# EAGLE design double_coil_driver (EAGLE 7.0.0)
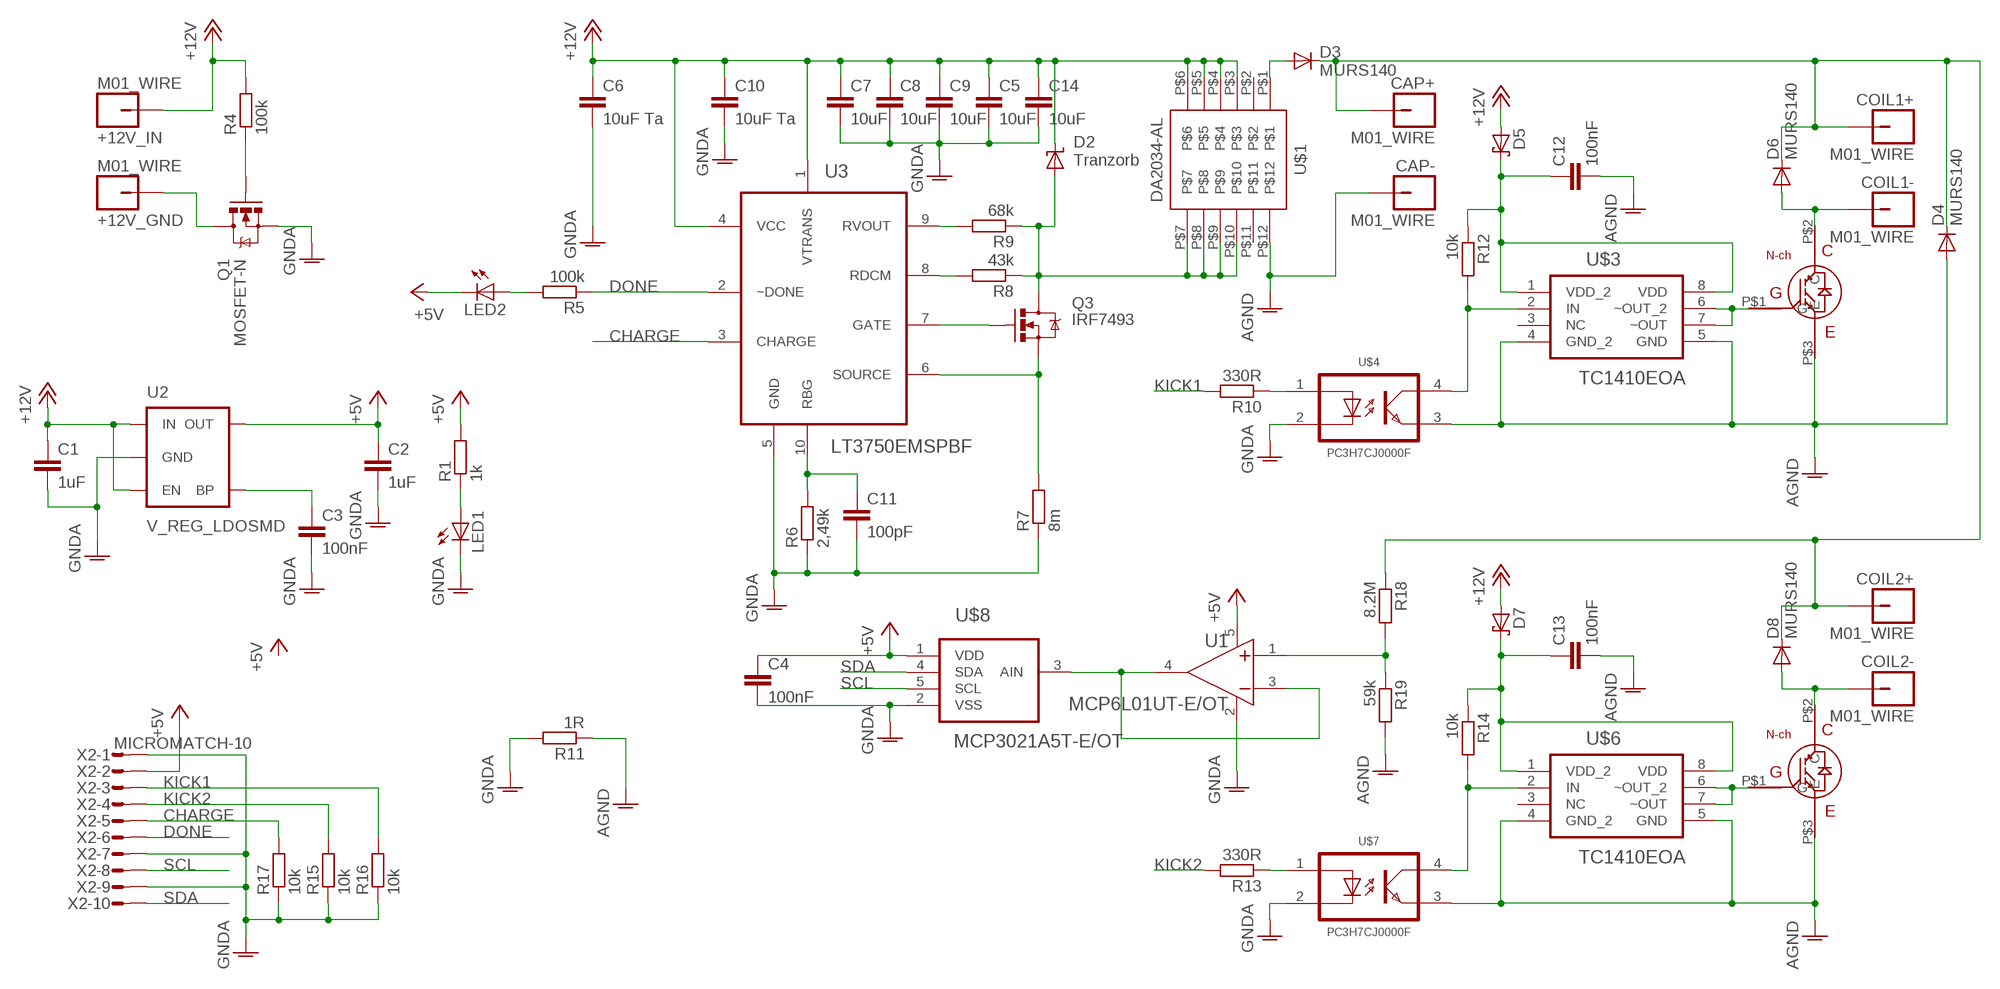
[diagram p0: schematic, sheet 1]

## Parts
+12V_GND  M01_WIRE  [WIRE_HOLE]
+12V_IN  M01_WIRE  [WIRE_HOLE]
C1  1uF  C-EUC1206K  [C1206K]
C2  1uF  C-EUC1206K  [C1206K]
C3  100nF  C-EUC0603K  [C0603K]
C4  100nF  C-EUC0603K  [C0603K]
C5  10uF  C-EUC1210K  [C1210K]
C6  10uF Ta  C-EUC1210K  [C1210K]
C7  10uF  C-EUC1210K  [C1210K]
C8  10uF  C-EUC1210K  [C1210K]
C9  10uF  C-EUC1210K  [C1210K]
C10  10uF Ta  C-EUC1210K  [C1210K]
C11  100pF  C-EUC0603  [C0603]
C12  100nF  C-EUC0603K  [C0603K]
C13  100nF  C-EUC0603K  [C0603K]
C14  10uF  C-EUC1210K  [C1210K]
CAP+  M01_WIRE  [WIRE_HOLE]
CAP-  M01_WIRE  [WIRE_HOLE]
COIL1+  M01_WIRE  [WIRE_HOLE]
COIL1-  M01_WIRE  [WIRE_HOLE]
COIL2+  M01_WIRE  [WIRE_HOLE]
COIL2-  M01_WIRE  [WIRE_HOLE]
D2  Tranzorb  SUPPRESSOR-SMC  [SMC]
D3  MURS140  DIODE-DO214AA  [DO214AA]
D4  MURS140  DIODE-DO214AA  [DO214AA]
D5  SCHOTTKY-DIODE  [SOD123]
D6  MURS140  DIODE-DO214AA  [DO214AA]
D7  SCHOTTKY-DIODE  [SOD123]
D8  MURS140  DIODE-DO214AA  [DO214AA]
LED1  LEDCHIP-LED0603  [CHIP-LED0603]
LED2  LEDCHIP-LED0603  [CHIP-LED0603]
Q1  MOSFET-N  MOSFET-NCHANNELFDS6630A  [SO08]
Q3  IRF7493  MOSFET-NCHANNELFDS6630A  [SO08]
R1  1k  R-EU_R0603  [R0603]
R4  100k  R-EU_R0603  [R0603]
R5  100k  R-EU_R0603  [R0603]
R6  2,49k  R-EU_R0603  [R0603]
R7  8m  R-EU_R2010  [R2010]
R8  43k  R-EU_R0603  [R0603]
R9  68k  R-EU_R0603  [R0603]
R10  330R  R-EU_R0603  [R0603]
R11  1R  R-EU_R0603  [R0603]
R12  10k  R-EU_R0603  [R0603]
R13  330R  R-EU_R0603  [R0603]
R14  10k  R-EU_R0603  [R0603]
R15  10k  R-EU_R0603  [R0603]
R16  10k  R-EU_R0603  [R0603]
R17  10k  R-EU_R0603  [R0603]
R18  8.2M  R-EU_R0603  [R0603]
R19  59k  R-EU_R0603  [R0603]
U1  MCP6L01UT-E/OT  [SOT95P270X145-5N]
U2  V_REG_LDOSMD  [SOT23-5]
U3  LT3750EMSPBF  [SOP50P490X110-10N]
U$1  DA2034-AL  DA2034-AL-SQUARE  [DA2034-AL]
U$2  TO-247A  [TO-247]
U$3  TC1410EOA  [SOIC127P600X175-8N]
U$4  PC3H7CJ0000F  [MINI-FLAT-HALF-PITCH-4]
U$5  TO-247A  [TO-247]
U$6  TC1410EOA  [SOIC127P600X175-8N]
U$7  PC3H7CJ0000F  [MINI-FLAT-HALF-PITCH-4]
U$8  MCP3021A5T-E/OT  [SOT95P270X145-5N]
X2  MICROMATCH-10  [MICROMATCH-10]

## Nets
+5V: C2.1 C4.1 LED2.C R1.2 U1.5(VDD) U2.5(OUT) U$8.1(VDD) X2.2
+12V: +12V_IN.P$1 C1.1 C5.1 C6.1 C7.1 C8.1 C9.1 C10.1 C14.1 D2.C D5.A D7.A R4.2 U2.1(IN) U2.3(EN) U3.1(VTRANS) U3.4(VCC) U$1.P$3 U$1.P$4 U$1.P$5 U$1.P$6
AGND: C12.2 C13.2 CAP-.P$1 D4.A R11.1 R19.2 U$1.P$12 U$2.P$3(E) U$3.4(GND_2) U$3.5(GND) U$4.3 U$5.P$3(E) U$6.4(GND_2) U$6.5(GND) U$7.3
CHARGE: R17.2 U3.3(CHARGE) X2.5
DONE: R5.1 U3.2(~DONE) X2.6
GNDA: C1.2 C2.2 C3.2 C4.2 C5.2 C6.2 C7.2 C8.2 C9.2 C10.2 C11.2 C14.2 LED1.C Q1.1(S) Q1.2(S) Q1.3(S) R6.1 R7.1 R11.2 R15.1 R16.1 R17.1 U1.2(VSS) U2.2(GND) U3.5(GND) U$4.2 U$7.2 U$8.2(VSS) X2.1 X2.7 X2.9
KICK1: R10.2 R16.2 X2.3
KICK2: R13.2 R15.2 X2.4
N$1: +12V_GND.P$1 Q1.5(D) Q1.6(D) Q1.7(D) Q1.8(D)
N$2: C3.1 U2.4(BP)
N$3: R18.2 R19.1 U1.1(VIN+)
N$4: LED1.A R1.1
N$5: U1.3(VIN-) U1.4(VOUT) U$8.3(AIN)
N$6: Q3.4(G) U3.7(GATE)
N$7: Q1.4(G) R4.1
N$8: LED2.A R5.2
N$9: C11.1 R6.2 U3.10(RBG)
N$10: Q3.1(S) Q3.2(S) Q3.3(S) R7.2 U3.6(SOURCE)
N$11: R8.2 U3.8(RDCM)
N$12: R9.2 U3.9(RVOUT)
N$13: D2.A Q3.5(D) Q3.6(D) Q3.7(D) Q3.8(D) R8.1 R9.1 U$1.P$7 U$1.P$8 U$1.P$9 U$1.P$10
N$14: D3.A U$1.P$1
N$15: CAP+.P$1 COIL1+.P$1 COIL2+.P$1 D3.C D4.C D6.C D8.C R18.1
N$16: COIL1-.P$1 D6.A U$2.P$2(C)
N$17: U$2.P$1(G) U$3.6(~OUT_2) U$3.7(~OUT)
N$18: R12.2 U$3.2(IN) U$4.4
N$19: R10.1 U$4.1
N$21: C12.1 D5.C R12.1 U$3.1(VDD_2) U$3.8(VDD)
N$23: COIL2-.P$1 D8.A U$5.P$2(C)
N$24: U$5.P$1(G) U$6.6(~OUT_2) U$6.7(~OUT)
N$25: R14.2 U$6.2(IN) U$7.4
N$26: R13.1 U$7.1
N$27: C13.1 D7.C R14.1 U$6.1(VDD_2) U$6.8(VDD)
SCL: U$8.5(SCL) X2.8
SDA: U$8.4(SDA) X2.10
Unconnected: U$1.P$2 U$1.P$11 U$3.3(NC) U$6.3(NC)

## Library data of the parts
+12V_GND +12V_IN CAP+ CAP- COIL1+ COIL1- COIL2+ COIL2- = tellis2:M01_WIRE
C1-C14 = rcl:C-EU: CAPACITOR, European symbol
D2 = diode:SUPPRESSOR-: Suppressor diode
D3 D4 D6 D8 = diode:DIODE-: DIODE
D5 D7 = diode:SCHOTTKY-DIODE: Schottky Diode
LED1 LED2 = led:LED: LED OSRAM: - CHIPLED LG R971, LG N971, LY N971, LG Q971, LY Q971, LO R971, LY R971 LH N974, LH R974 LS Q976, LO Q976, LY Q976 LO Q996 - Hyper CHIPLED LW Q18S LB Q993, LB Q99A, LB R99A - SideLED LS A670, LO A670, LY A670, LG A670, LP A670 LB A673, LV A673, LT A673, LW A673 LH A674 LY A675 LS A676, LA A676, LO A676, LY A676, LW A676 LS A679, LY A679, LG A679 - Hyper Micro SIDELED® LS Y876, LA Y876, LO Y876, LY Y876 LT Y87S - SmartLED LW L88C, LW L88S LB L89C, LB L89S, LG L890 LS L89K, LO L89K, LY L89K LS L896, LA L896, LO L896, LY L896 - TOPLED LS T670, LO T670, LY T670, LG T670, LP T670 LSG T670, LSP T670, LSY T670, LOP T670, LYG T670 LG T671, LOG T671, LSG T671 LB T673, LV T673, LT T673, LW T673 LH T674 LS T676, LA T676, LO T676, LY T676, LB T676, LH T676, LSB T676, LW T676 LB T67C, LV T67C, LT T67C, LS T67K, LO T67K, LY T67K, LW E67C LS E67B, LA E67B, LO E67B, LY E67B, LB E67C, LV E67C, LT E67C LW T67C LS T679, LY T679, LG T679 LS T770, LO T770, LY T770, LG T770, LP T770 LB T773, LV T773, LT T773, LW T773 LH T774 LS E675, LA E675, LY E675, LS T675 LS T776, LA T776, LO T776, LY T776, LB T776 LHGB T686 LT T68C, LB T68C - Hyper Mini TOPLED® LB M676 - Mini TOPLED Santana® LG M470 LS M47K, LO M47K, LY M47K Source: http://www.osram.convergy.de LUXEON: - LUMILED® LXK2-PW12-R00, LXK2-PW12-S00, LXK2-PW14-U00, LXK2-PW14-V00 LXK2-PM12-R00, LXK2-PM12-S00, LXK2-PM14-U00 LXK2-PE12-Q00, LXK2-PE12-R00, LXK2-PE12-S00, LXK2-PE14-T00, LXK2-PE14-U00 LXK2-PB12-K00, LXK2-PB12-L00, LXK2-PB12-M00, LXK2-PB14-N00, LXK2-PB14-P00, LXK2-PB14-Q00 LXK2-PR12-L00, LXK2-PR12-M00, LXK2-PR14-Q00, LXK2-PR14-R00 LXK2-PD12-Q00, LXK2-PD12-R00, LXK2-PD12-S00 LXK2-PH12-R00, LXK2-PH12-S00 LXK2-PL12-P00, LXK2-PL12-Q00, LXK2-PL12-R00 Source: www.luxeon.com KINGBRIGHT: KA-3528ASYC Source: www.kingbright.com
Q1 Q3 = SparkFun-DiscreteSemi:MOSFET-NCHANNEL: Common NMOSFET Parts MFG P/N Store ID Prod ID FDD8780 TRANS-09984 SI7820DN TRANS-11055 FDS6630A IC-08089 2N7002PW TRANS-11151 FQP30N06L COM-10213 TRANS-10060 BSS123LT1G TRANS-08345 BSS138 TRANS-00830 BS170 2N7000; PROD_ID: IC-08089
R1 R4-R19 = rcl:R-EU_: RESISTOR, European symbol
U1 = opamp-MCP6L01U:MCP6L01UT-E/OT: IC, 1 MHz, 85 uA Single Op Amps, 1.8V, SOT23-5; MPN: MCP6L01UT-E/OT; OC_FARNELL: 1852141; OC_NEWARK: 08R1813; PACKAGE: SOT23-5; SUPPLIER: Microchip
U2 = SparkFun-PowerIC:V_REG_LDO: Voltage Regulator LDO Standard 150mA LDO voltage regulator in SOT-23 layout. Micrel part MIC5205. BP (by-pass) pin is used to lower output noise with 470pF cap.
U3 = LT3750:LT3750EMSPBF: Capacitor Charger Controller; MPN: LT3750EMS#PBF; OC_FARNELL: 1273500; OC_NEWARK: 57M8591; PACKAGE: MSOP-10; SUPPLIER: Linear Technology
U$1 = inductor-coilcraft-2:DA2034-AL-SQUARE
U$2 U$5 = to-247_n-channel_igbt-modified-pads:TO-247
U$3 U$6 = TC1410:TC1410EOA: 0.5A High-Speed MOSFET Drivers; MPN: TC1410EOA; OC_FARNELL: 1834893; OC_NEWARK: 92C5892; PACKAGE: SOIC-8; SUPPLIER: Microchip
U$4 U$7 = optocoupler-PC3H7CJ0000F:PC3H7CJ0000F
U$8 = ADC-I2C-MCP3021:MCP3021A5T-E/OT: A/D Converter; MPN: MCP3021A5T-E/OT; OC_FARNELL: 1332097; OC_NEWARK: 34M7445; PACKAGE: SOT-5; SUPPLIER: Microchip
X2 = con-amp-micromatch:MICROMATCH-10: MicroMaTch 10 8-215464-0 / 1-215464-0 Drawing Number C-215464 DDEController.pdf; MF: FARNELL; MPN: 8-215464-0; OC_FARNELL: 3784654; OC_NEWARK: 19J6430

## Board
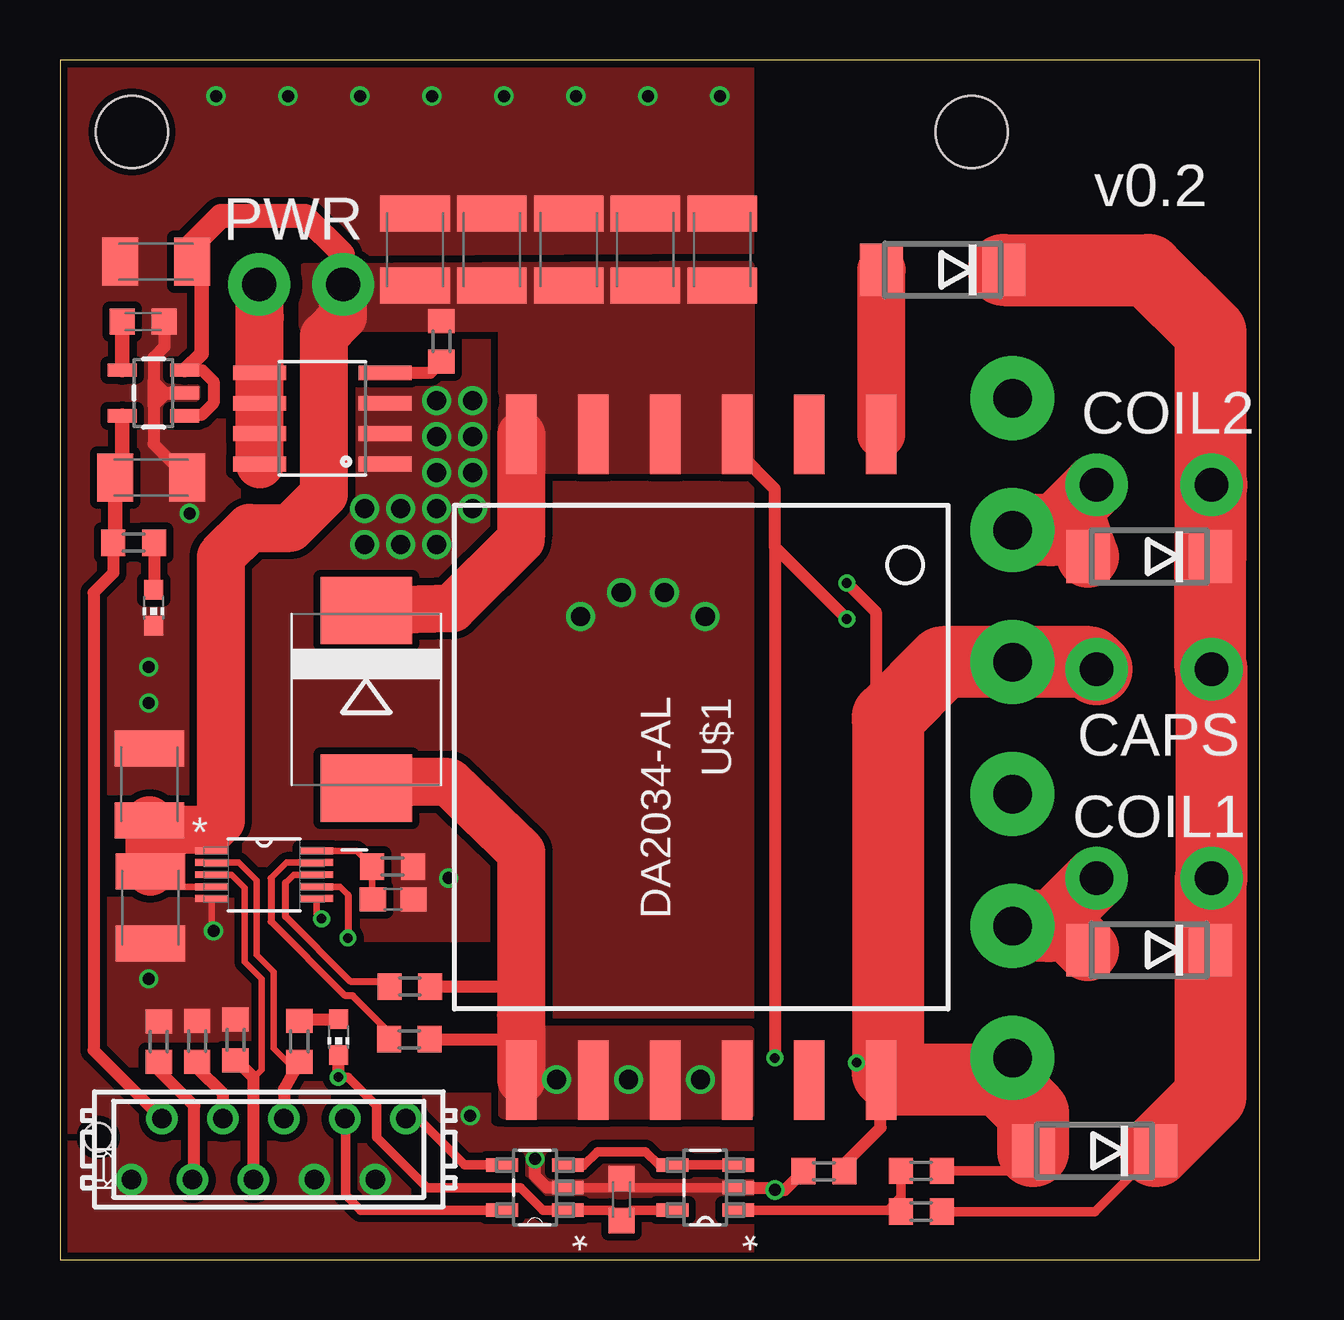
[diagram p1: board, top side]
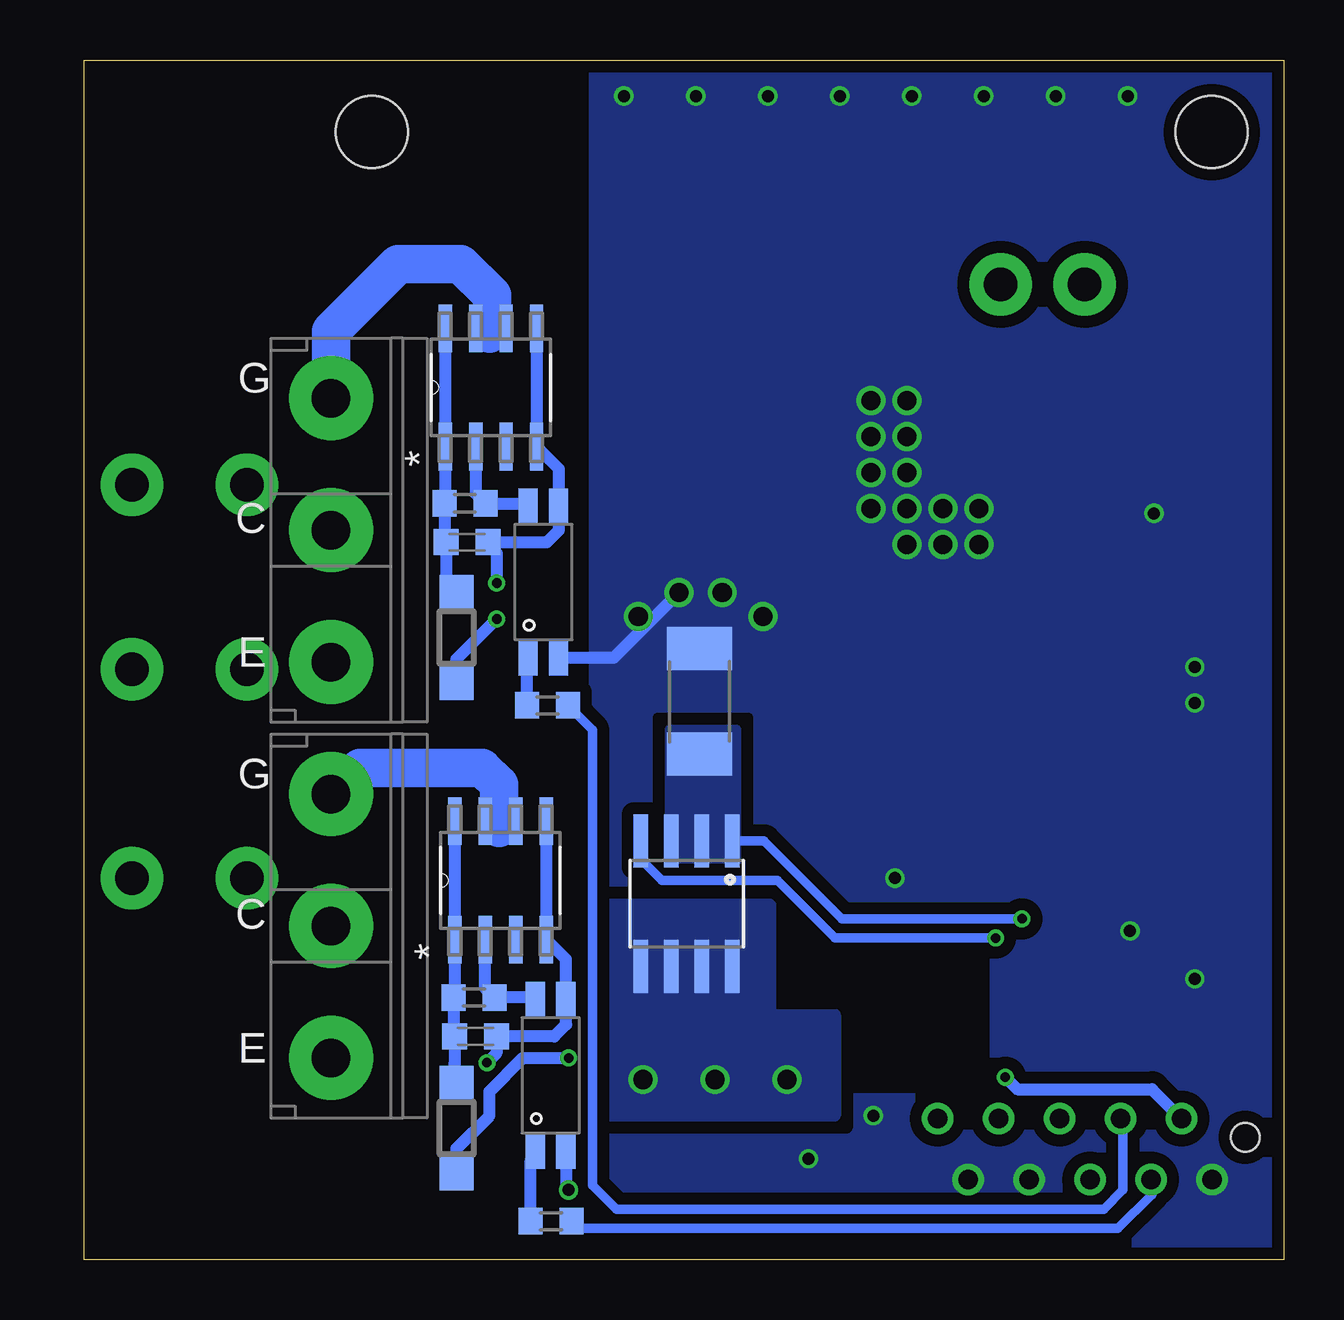
[diagram p2: board, bottom side, seen from below]

Size 50 x 50 mm. Coordinates in mm from the lower left corner, seen from the top.
Outline: 0,0 50,0 50,50 0,50 0,0
Copper layers (1*16): Top 0.035mm / dielectric 1.5mm / Bottom 0.035mm
Design rules "ITEADstudio_DRC *": minimum track width 6mil, minimum drill 12mil, track to track 0.2mm, track to pad 0.2mm, pad to pad 0.2mm, via to via 0.2mm, smd to smd 0mil, copper to edge 10mil, drill to drill 10mil, minimum pad ring 10mil, minimum via ring 6mil, stop-mask expansion 2mil, vias tented up to drill 100mil, thermal gap 10mil
Holes 3 mm at 3,47 38,47
Holes 1.2 mm at 1.6,5.1

### Footprints (pad centres in the part's own frame; a part is rotated, then mirrored left to right if it is on the bottom)
WIRE_HOLE = drill 1.4 pad 2.6: P$1 0,0
C1206K = smd 1.5 x 2: 1 -1.5,0; 2 1.5,0
C0603K = smd 1.05 x 1.08: 1 -0.875,0; 2 0.875,0
C1210K = smd 1.5 x 2.9: 1 -1.5,0; 2 1.5,0
C0603 = smd 1.1 x 1: 1 -0.85,0; 2 0.85,0
SMC = smd 2.8 x 3.8: A 3.7,0; C -3.7,0
DO214AA = smd 1.8 x 2.2: A 2.55,0; C -2.55,0
SOD123 = smd 1.4 x 1.4: A 1.9,0; C -1.9,0
CHIP-LED0603 = smd 0.8 x 0.8: A 0,-0.75; C 0,0.75
SO08 = smd 0.61 x 2.21: 1 -1.905,-2.616; 2 -0.635,-2.616; 3 0.635,-2.616; 4 1.905,-2.616; 5 1.905,2.616; 6 0.635,2.616; 7 -0.635,2.616; 8 -1.905,2.616
R0603 = smd 1 x 1.1: 1 -0.85,0; 2 0.85,0
R2010 = smd 1.8 x 2.7: 1 -2.2,0; 2 2.2,0
SOT95P270X145-5N = smd 1.321 x 0.559: 1 -1.372,0.94; 2 -1.372,0; 3 -1.372,-0.94; 4 1.372,-0.94; 5 1.372,0.94
SOT23-5 = smd 0.55 x 1.2: 1 -0.95,-1.3; 2 0,-1.3; 3 0.95,-1.3; 4 0.95,1.3; 5 -0.95,1.3
SOP50P490X110-10N = smd 1.397 x 0.279: 1 -2.184,0.991; 2 -2.184,0.508; 3 -2.184,0; 4 -2.184,-0.508; 5 -2.184,-0.991; 6 2.184,-0.991; 7 2.184,-0.508; 8 2.184,0; 9 2.184,0.508; 10 2.184,0.991
DA2034-AL = smd 3.3 x 1.27: P$1 -13.46,7.5; P$2 -13.46,4.5; P$3 -13.46,1.5; P$4 -13.46,-1.5; P$5 -13.46,-4.5; P$6 -13.46,-7.5; P$7 13.46,-7.5; P$8 13.46,-4.5; P$9 13.46,-1.5; P$10 13.46,1.5; P$11 13.46,4.5; P$12 13.46,7.5
TO-247 = drill 1.6 pad 3.5: P$1 0,5.5; P$2 0,0; P$3 0,-5.5
SOIC127P600X175-8N = smd 1.981 x 0.559: 1 -2.464,1.905; 2 -2.464,0.635; 3 -2.464,-0.635; 4 -2.464,-1.905; 5 2.464,-1.905; 6 2.464,-0.635; 7 2.464,0.635; 8 2.464,1.905
MINI-FLAT-HALF-PITCH-4 = smd 1.5 x 0.8: 1 -3.15,0.635; 2 -3.15,-0.635; 3 3.15,-0.635; 4 3.15,0.635
MICROMATCH-10 = drill 0.813: 1 5.715,1.27; 2 4.445,-1.27; 3 3.175,1.27; 4 1.905,-1.27; 5 0.635,1.27; 6 -0.635,-1.27; 7 -1.905,1.27; 8 -3.175,-1.27; 9 -4.445,1.27; 10 -5.715,-1.27

### Placement (x,y rotation side)
+12V_GND  8.3,40.65 0 top
+12V_IN  11.8,40.65 0 top
C1  4,41.6 180 top
C2  3.8,32.6 0 top
C3  3.47,39.1 0 top
C4  23.4,2.5 90 top
C5  18,42.1 90 top
C6  3.77,14.67 270 top
C7  21.2,42.1 90 top
C8  24.4,42.1 90 top
C9  27.6,42.1 90 top
C10  3.73,19.81 90 top
C11  13.89,15.01 0 top
C12  33.68,9.3 0 bottom
C13  34.03,29.9 0 bottom
C14  14.8,42.1 90 top
CAP+  48,24.6 0 top
CAP-  43.2,24.6 0 top
COIL1+  48,32.3 0 top
COIL1-  43.2,15.9 0 top
COIL2+  48,15.9 0 top
COIL2-  43.2,32.3 0 top
D2  12.77,23.35 270 top
D3  36.79,41.25 180 top
D4  43.12,4.53 180 top
D5  34.47,5.48 270 bottom
D6  45.4,12.9 180 top
D7  34.47,25.93 270 bottom
D8  45.4,29.3 180 top
LED1  3.9,27.17 180 top
LED2  11.61,9.27 180 top
Q1  10.94,35.06 90 top
Q3  24.88,14.84 180 bottom
R1  3.07,29.88 180 top
R4  15.9,38.27 90 top
R5  9.98,9.09 90 top
R6  13.86,16.38 180 top
R7  24.34,23.27 270 bottom
R8  14.58,11.38 180 top
R9  14.56,9.18 180 top
R10  30.53,1.6 0 bottom
R11  31.84,3.68 180 top
R12  33.74,10.92 0 bottom
R13  30.68,23.1 0 bottom
R14  34.12,31.52 0 bottom
R15  5.72,9.1 270 top
R16  4.12,9.08 270 top
R17  7.32,9.16 270 top
R18  35.9,2 180 top
R19  35.9,3.7 0 top
U1  26.9,3 180 top
U2  3.9,36.12 90 top
U3  8.51,16.04 0 top
U$1  26.73,20.94 270 top
U$2  39.7,13.9 0 bottom
U$3  32.64,15.8 90 bottom
U$4  30.55,7.68 90 bottom
U$5  39.7,30.4 0 bottom
U$6  33.04,36.35 90 bottom
U$7  30.85,28.24 90 bottom
U$8  19.8,3 180 top
X2  8.7,4.6 180 top

### Tracks (layer width: path | path; a pad name or v marks a point on that pad's centre or on a via)
+5V  (via drill 0.4)
  Top 0.4: U1.5 23.84,2.06 C4.1 22.96,2.06 U$8.1 20.14,2.06 19.2,3 15.3,3 13.2,5.1 13.2,6.4 12,7.6 v11.6,7.6
  Top 0.5: R1.2 2.22,28.62 1.4,27.8 1.4,8.72 X2.2 | LED2.C 11.6,8.61 v11.6,7.6
  Top 0.6: U2.5 2.6,32.9 C2.1 2.3,29.96 R1.2
  Bottom 0.5: v11.6,7.6 11.1,7.1 5.49,7.1 X2.2
+12V  (via drill 0.4)
  Top 0.28: U3.1 6.33,17.87 | U3.4 4.41,15.53
  Top 0.3: 6.33,17.87 6.3,17.9 | 4.41,15.53 C6.1
  Top 0.5: 5.17,35.2 U2.1 5.23,35.2 5.9,35.2 6.4,35.7 6.4,36.6 5.93,37.07 U2.3 | U$1.P$3 28.23,33.67 29.8,32.1 29.8,29.7 | 29.8,29.7 v29.8,8.4 | v32.8,26.7 29.8,29.7
  Top 0.6: U2.3 5.9,37.77 5.9,40.7 5.5,41.1 C1.1
  Top 1: +12V_IN.P$1 11.8,41.9 10.2,43.5 6.7,43.5 5.5,42.3 C1.1
  Top 2: U$1.P$6 19.23,30.31 19.2,30 16.35,27.15 D2.C | C6.1 3.73,16.33 C10.1 4.04,17.9 6.3,17.9 6.7,18.3 6.7,29.3 7.9,30.5 9.6,30.5 11,31.9 11,38.5 11.8,39.3 +12V_IN.P$1
  Bottom 0.5: 34.47,23.87 D7.A 34.47,25.03 v32.8,26.7 | D5.A 34.47,4.63 33.1,6 33.1,7 31.7,8.4 v29.8,8.4
  pour Top (isolate 0.5, no thermals): 28.7,33 18.5,33 18.5,38.9 10.2,38.9 10.2,41.3 28.7,41.4
AGND  (via drill 0.4)
  Top 0.4: R19.2 39.84,3.7 D4.A
  Top 0.5: 34.8,7.5 34.78,7.48 U$1.P$12 | U$1.P$12 34.9,8.05 34.9,8.9 | U$1.P$12 34.22,7.78 33.8,8.2 v33.2,8.2 | R11.1 32.69,3.99 34.2,5.5 34.2,7.45 U$1.P$12 | v32.8,28.2 34,27 34,23.7 34.5,23.2 34.5,22.5
  Top 2: 39.2,7.48 39.18,7.5
  Top 3: D4.A 40.57,6.11 39.2,7.48 | 39.18,7.5 38.8,7.5 | 38.8,7.5 34.8,7.5 34.5,7.8 34.5,22.5 34.5,22.6 36.8,24.9 U$5.P$3 42.9,24.9 CAP-.P$1 | U$2.P$3 38.8,7.5
  Bottom 0.5: U$3.5 U$3.4 29.91,12.52 U$4.3 29.9,10.62 29.9,9.8 30.4,9.3 C12.2 | 32.6,9.3 C12.2 | v32.8,28.2 32.8,29.45 C13.2 30.7,29.9 30.2,30.4 30.2,31.38 U$7.3 30.21,32.97 U$6.4 U$6.5 | C12.2 32.8,8.6 v33.2,8.2
CHARGE
  Top 0.28: U3.3 7.16,16.04 7.7,15.5 7.7,12.4 8.4,11.7 8.4,7.9 8.06,7.57
  Top 0.5: X2.5 8.06,7.3 8.06,7.57 R17.2
DONE
  Top 0.28: U3.2 7.45,16.55 8.2,15.8 8.2,12.7 8.9,12 8.9,8.8 9.46,8.24 R5.1
  Top 0.5: R5.1 9.34,7.09 X2.6
GNDA  (via drill 0.5, 0.8)
  Top 0.28: U3.5 6.33,13.77
  Top 0.3: 6.33,13.77 v6.4,13.7
  Top 0.4: 21.2,2.98 U$8.2 23.02,3 C4.2 23.77,3 U1.2 28.25,2.98
  Top 0.5: U$8.2 20.3,3 19.8,3.5 v19.8,4.2 | C3.2 4.34,38.05 3.9,37.6 3.9,36.6 | 3.9,36.6 4.4,36.1 5.18,36.1 U2.2 4.42,36.12 3.9,35.6 | 3.9,35.6 3.9,36.6 | 3.9,35.6 3.9,34 C2.2 | U1.2 29.7,3 v29.8,2.9 30.21,2.9 R11.2
  Bottom 0.5: U$4.2 29.91,3.02 v29.8,2.9 | U$7.2 27.91,25.09 v25.2,27.8
  other vias: 5.4,31.1 3.7,11.7 17.1,6 23.4,27.8 3.7,24.7 3.7,23.2 16.2,15.9 15.7,35.8 15.7,34.3 15.7,31.3 12.7,29.8 21.7,26.8 26.9,26.8 6.5,48.5 9.5,48.5 12.5,48.5 15.5,48.5 18.5,48.5 21.5,48.5 24.5,48.5 27.5,48.5 17.2,34.3 17.2,32.8 17.2,31.3 15.7,29.8 14.2,29.8 15.7,32.8 17.2,35.8 14.2,31.3 12.7,31.3
  pour Bottom (isolate 0.5, rank 2, no thermals): 0,0 28.7,0 28.7,50 0,50
  pour Top (isolate 0.3, rank 2, no thermals): 0,0 28.7,0 28.7,50 0,50
KICK1
  Top 0.3: 5.53,3.17 X2.3
  Top 0.5: X2.3 5.6,3.4 5.6,6.4 4.1,7.9 4.1,8.21 R16.2
  Bottom 0.4: R10.2 29.3,1.3 6.9,1.3 5.5,2.7 5.5,3.31 X2.3
KICK2
  Top 0.5: X2.4 6.8,6.9 5.7,8 5.7,8.23 R15.2
  Bottom 0.4: R13.2 28.8,22.07 28.8,3.1 27.8,2.1 7.5,2.1 6.7,2.9 6.7,5.78 X2.4
N$1
  Top 2: Q1.8 Q1.7 Q1.6 Q1.5 8.32,39.27 +12V_GND.P$1
N$2
  Top 0.6: C3.1 U2.4
N$3
  Top 0.4: U1.1 34.5,2.06 | 34.5,2.06 34.99,2.06 R18.2 | R19.1 35.05,2.61 34.5,2.06
N$4
  Top 0.5: R1.1 3.92,27.8 LED1.A
N$5
  Top 0.4: U1.3 U1.4 24.96,3.94 24.4,4.5 22.4,4.5 21.8,3.9 21.21,3.9 U$8.3
N$6  (via drill 0.4)
  Top 0.28: U3.7 11.67,15.53 12,15.2
  Top 0.3: 12,15.2 v12,13.4
  Bottom 0.4: Q3.4 26.8,17.44 26.8,16.7 25.9,15.8 21.1,15.8 18.7,13.4 v12,13.4
N$7
  Top 0.5: Q1.4 15.45,36.97 R4.1
N$8
  Top 0.5: R5.2 10,10.02 LED2.A
N$9
  Top 0.28: U3.10 12.36,17.03 R6.2 13.01,14.94 C11.1
N$10  (via drill 0.4)
  Top 0.28: U3.6 10.69,14.41 v10.9,14.2
  Bottom 0.4: Q3.1 21.66,17.46 18.4,14.2 v10.9,14.2
  pour Bottom (isolate 0.5, no thermals): 22.8,16.5 25.6,16.5 25.6,22.1 22.8,22.1
N$11
  Top 0.28: U3.8 9.74,16.04 9.4,15.7
  Top 0.3: 9.4,15.7 9.4,14.3 12.1,11.6 13.51,11.6 R8.2
N$12
  Top 0.28: U3.9 9.45,16.55 8.8,15.9
  Top 0.3: 8.8,15.9 8.8,14.09 11.89,11 12.2,11 13.81,9.39 R9.2
N$13  (via drill 0.8)
  Top 0.5: 18.45,10.18 19.23,9.4 | R8.1 18.95,11.38 19.23,11.1 | R9.1 19.15,9.18 19.23,9.1
  Top 2: U$1.P$7 19.23,9.1 19.23,9.4 19.23,11.1 19.23,16.97 16.2,19.9 13.32,19.9 D2.A
  other vias: 20.7,7.5 23.7,7.5 26.7,7.5
  pour Bottom (isolate 0.5, no thermals): 18.7,6 28.7,6 28.7,14.8 21.4,14.8 21.4,10.2 18.7,10.2
  pour Top (isolate 0.5, no thermals): 18.5,6.1 28.7,6.1 28.7,9.5 18.5,9.5
N$14
  Top 2: U$1.P$1 D3.A
N$15
  Top 0.4: R18.1 43.14,2 D4.C
  Top 3: D3.C 45.35,41.25 47.95,38.65 47.95,32.25 | COIL1+.P$1 47.95,32.25 | 47.95,32.25 D8.C 47.95,24.65 CAP+.P$1 COIL2+.P$1 47.95,15.85 D6.C 47.95,6.81 D4.C
N$16
  Top 2.6: COIL1-.P$1 41.2,13.9 | D6.A 42.05,13.7 U$2.P$2
  Top 3: 41.2,13.9 U$2.P$2
N$17
  Bottom 0.5: U$3.6 32.24,18.5 32.7,18 32.94,17.76 U$3.7
  Bottom 1.6: U$2.P$1 39.6,19.4 38.5,20.5 33.4,20.5 32.7,19.8 32.7,18
N$18
  Bottom 0.5: U$3.2 33.27,11.3 R12.2 31.07,10.92 U$4.4
N$19
  Bottom 0.5: R10.1 31.38,4.12 U$4.1
N$20
  cutout Top: 12.5,13 18,13 18,7.2 12.5,7.2
N$21
  Bottom 0.5: U$3.8 U$3.1 34.55,10.96 R12.1 34.59,9.34 C12.1 34.55,8.16 D5.C
N$22
  cutout Bottom: 12.5,13 18,13 18,7.2 12.5,7.2
N$23
  Top 2.6: COIL2-.P$1 41.3,30.4 42.45,30.4 D8.A
  Top 3: 41.3,30.4 U$5.P$2
N$24
  Bottom 0.5: U$6.6 32.62,38.6 33.1,38.6 33.31,38.81 U$6.7
  Bottom 1.6: U$5.P$1 39.7,38.7 36.9,41.5 34.3,41.5 33,40.2 33,38.7 33.1,38.6
N$25
  Bottom 0.5: U$6.2 33.67,31.93 R14.2 31.61,31.52 U$7.4
N$26
  Bottom 0.5: R13.1 31.53,25.05 U$7.1
N$27
  Bottom 0.5: U$6.8 U$6.1 34.95,31.55 R14.1 34.97,29.96 C13.1 34.91,27.96 D7.C
SCL
  Top 0.4: U$8.5 12.54,2.06 11.9,2.7 11.9,5.84 X2.8
SDA
  Top 0.4: U$8.4 16.86,3.94 15,5.8 14.48,5.8 X2.10

### Text on the board
tNames: v0.2 | PWR | COIL2 | CAPS | COIL1